# Altium schematic sheet analog.SchDoc: Scalony Skaner Bioimpedancji
size A4; DrawnBy: Łukasz Przeniosło; Organization: Zachodniopomorski; Address1: Uniwersytet Technologiczny; Address2: w Szczecinie; Address3: Wydział Elektryczny; Address4: Katedra KISSE; Revision: 1.0; SheetNumber: 3; SheetTotal: 7
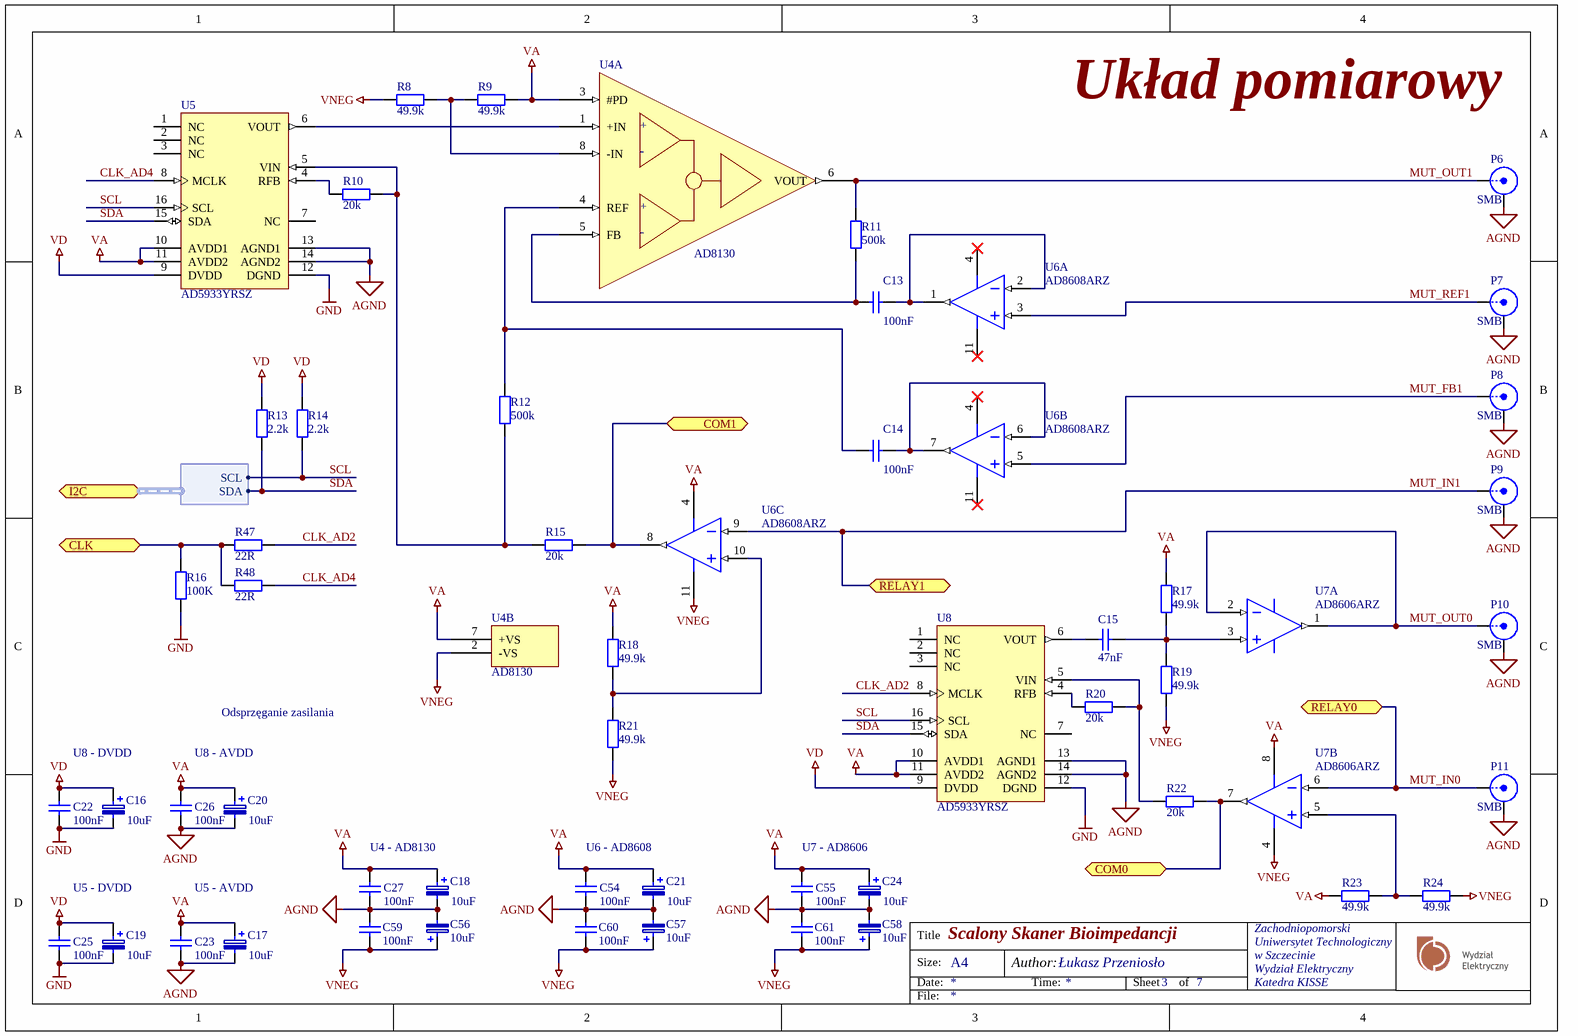
[diagram p0: analog.SchDoc]

## Parts
(Parts that share a designator on the sheet are numbered #1, #2 ... from top to bottom, then left to right.)
C13  100nF  [CAPC1608N]
C14  100nF  [CAPC1608N]
C15  47nF  [CAPC1608N]
C16  10uF  [SMDA]
C17  10uF  [SMDA]
C18  10uF  [SMDA]
C19  10uF  [SMDA]
C20  10uF  [SMDA]
C21  10uF  [SMDA]
C22  100nF  [CAPC1608N]
C23  100nF  [CAPC1608N]
C24  10uF  [SMDA]
C25  100nF  [CAPC1608N]
C26  100nF  [CAPC1608N]
C27  100nF  [CAPC1608N]
C54  100nF  [CAPC1608N]
C55  100nF  [CAPC1608N]
C56  10uF  [SMDA]
C57  10uF  [SMDA]
C58  10uF  [SMDA]
C59  100nF  [CAPC1608N]
C60  100nF  [CAPC1608N]
C61  100nF  [CAPC1608N]
P6  SMB  [SMB_V-RJ45]
P7  SMB  [SMB_V-RJ45]
P8  SMB  [SMB_V-RJ45]
P9  SMB  [SMB_V-RJ45]
P10  SMB  [SMB_V-RJ45]
P11  SMB  [SMB_V-RJ45]
R8  49.9k  [RESC1608N]
R9  49.9k  [RESC1608N]
R10  20k  [RESC1608N]
R11  500k  [RESC1608N]
R12  500k  [RESC1608N]
R13  2.2k  [RESC1608N]
R14  2.2k  [RESC1608N]
R15  20k  [RESC1608N]
R16  100K  [RESC1608N]
R17  49.9k  [RESC1608N]
R18  49.9k  [RESC1608N]
R19  49.9k  [RESC1608N]
R20  20k  [RESC1608N]
R21  49.9k  [RESC1608N]
R22  20k  [RESC1608N]
R23  49.9k  [RESC1608N]
R24  49.9k  [RESC1608N]
R47  22R  [RESC1608N]
R48  22R  [RESC1608N]
U4  AD8130  [SO-8_M]  (parts A,B of 2)
U5  AD5933YRSZ  [ADI-RS-16_L]
U6  AD8608ARZ  [ADI-R-14_N]  (parts A,B,C of 4)
U7#1  AD8606ARZ  [SOIC127P600-8AL]  (part A of 2)
U7#2  AD8606ARZ  [SOIC127P600-8AL]  (part B of 2)
U8  AD5933YRSZ  [ADI-RS-16_L]

## Ports
CLK, COM0, COM1, I2C (harness I2C), RELAY0, RELAY1

## Harnesses
I2C: SCL, SDA

## Nets
AGND: C17.2 C18.2 C20.2 C21.2 C23.1 C24.2 C26.1 C27.1 C54.1 C55.1 C56.2 C57.2 C58.2 C59.1 C60.1 C61.1 P6.2(Y) P7.2(Y) P8.2(Y) P9.2(Y) P10.2(Y) P11.2(Y) U5.13(AGND1) U5.14(AGND2) U8.13(AGND1) U8.14(AGND2)
GND: C16.2 C19.2 C22.1 C25.1 R16.2 U5.12(DGND) U8.12(DGND)
VA: C17.1 C18.1 C20.1 C21.1 C23.2 C24.1 C26.2 C27.2 C54.2 C55.2 R9.1 R17.1 R18.1 R23.1 U4.3(#PD) U4.7(+VS) U5.10(AVDD1) U5.11(AVDD2) U6.4(+V) U7#2.8(+V) U8.10(AVDD1) U8.11(AVDD2)
VD: C16.1 C19.1 C22.2 C25.2 R13.1 R14.1 U5.9(DVDD) U8.9(DVDD)
VNEG: C56.1 C57.1 C58.1 C59.2 C60.2 C61.2 R8.2 R19.2 R21.2 R24.2 U4.2(-VS) U6.11(-V) U7#2.4(-V)
CLK: R16.1 R47.2 R48.2 ; port CLK
CLK_AD2: R47.1 U8.8(MCLK)
CLK_AD4: R48.1 U5.8(MCLK)
COM0: R22.1 U7#2.7(OUT_B) ; port COM0
COM1: R15.1 U6.8(OUT_C) ; port COM1
MUT_FB1: P8.1(X) U6.5(+IN_B)
MUT_IN0: P11.1(X) U7#2.6(-IN_B) ; port RELAY0
MUT_IN1: P9.1(X) U6.9(-IN_C) ; port RELAY1
MUT_OUT0: P10.1(X) U7#1.1(OUT_A) U7#1.2(-IN_A)
MUT_OUT1: P6.1(X) R11.1 U4.6(VOUT)
MUT_REF1: P7.1(X) U6.3(+IN_A)
SCL: R14.2 U5.16(SCL) U8.16(SCL) ; port I2C.SCL
SDA: R13.2 U5.15(SDA) U8.15(SDA) ; port I2C.SDA
NetC13_1: C13.1 U6.1(OUT_A) U6.2(-IN_A)
NetC13_2: C13.2 R11.2 U4.5(FB)
NetC14_1: C14.1 U6.6(-IN_B) U6.7(OUT_B)
NetC14_2: C14.2 R12.1 U4.4(REF)
NetC15_1: C15.1 R17.2 R19.1 U7#1.3(+IN_A)
NetC15_2: C15.2 U8.6(VOUT)
NetR8_1: R8.1 R9.2 U4.8(-IN)
NetR10_1: R10.1 R12.2 R15.2 U5.5(VIN)
NetR10_2: R10.2 U5.4(RFB)
NetR18_2: R18.2 R21.1 U6.10(+IN_C)
NetR20_1: R20.1 U8.4(RFB)
NetR20_2: R20.2 R22.2 U8.5(VIN)
NetR23_2: R23.2 R24.1 U7#2.5(+IN_B)
NetU4_1: U4.1(+IN) U5.6(VOUT)

Not connected (* = marked no-connect by the designer): U5 1(NC) 2(NC) 3(NC) 7(NC); U7#1 4(-V) 8(+V); U8 1(NC) 2(NC) 3(NC) 7(NC)

## Notes on the sheet
- Układ pomiarowy
- Odsprzęganie zasilania
- U8 - DVDD
- U8 - AVDD
- U4 - AD8130
- U6 - AD8608
- U7 - AD8606
- U5 - DVDD
- U5 - AVDD
- Title
- Size:
- Date:
- A4
- Author:
- Time:
- Sheet
- of
- File:
- (in symbol AD8130, part A) +; -

## Library data of the parts
C13-C15 C22 C23 C25-C27 C54 C55 C59-C61 = Capacitor
  C13 C14 C22 C23 C25-C27 C54 C55 C59-C61: Value: 100nF
  C15: Value: 47nF
C16-C21 C24 C56-C58 = 100uF 6.3V-SMDB: Polarized Capacitor (Surface Mount); PackageReference: SMDB; Manufacturer: *; Manufacturer Part No.: *; Distributor: tme.pl; Distributor Order Code: TC 100/6.3-SMDB; tme.pl: TC 100/6.3-SMDB; Value: 10uF; farnell: 1135048
P6-P11 = SMB: SMB Straight Connector; LatestRevisionDate: 17-Jul-2002; LatestRevisionNote: Re-released for DXP Platform.; Publisher: Altium Limited
R8-R12 R15 R17-R24 R47 R48 = Resistor: Tolerance: 5%; Power: 0W
  R8 R9 R17-R19 R21 R23 R24: Value: 49.9k
  R10 R15 R20 R22: Value: 20k
  R11 R12: Value: 500k
  R47 R48: Value: 22R
R13 R14 R16 = Resistor: Power: 0W; Tolerance: 5%
  R13 R14: Value: 2.2k
  R16: Value: 100K
U5 U8 = CMP-0293-00046-1: 1 MSPS, 12-Bit Impedance Converter, Network Analyzer, Serial, RS-16, 77 Tube, Pb-Free; Tuning Word Width (bits): 27bit; I Supply total (max): 15mA; Master fclk: 16.776MHz; Resolution (Bits): 12bit; PackageVersion: 3/17/2005; I/O Interface: Serial; ComponentLink2URL: http://www.analog.com/static/imported-files/data_sheets/AD5933.pdf; PackageReference: RS-16; ComponentLink2Description: Datasheet; ComponentLink1URL: www.analog.com; Code_JEDEC: MO-150-AC; PackageDescription: 16-Lead Shrink Small Outline Package [SSOP]; ComponentLink1Description: Manufacturer URL; ComponentLink3URL: http://www.analog.com/static/imported-files/packages/31572257652246RS_16.pdf; ComponentLink3Description: Package Specification; DatasheetVersion: Rev. D
U6 = CMP-0384-00479-2: Quad Channel Wide Bandwidth Operational Amplifier, 10 MHz BW, 5 V/us SR, Industrial, 14-pin SOIC (R-14), Tube; Manufacturer: Analog Devices; Generic Part Number: AD8608; V Span Min: 2.7V; V Span Max: 6V; Input Bias Current: 200fA; Amplifiers Per Package: 4; Small Signal Bandwidth: 10MHz; Input Offset Voltage: 20uV; Slew Rate: 5V/us; Iq/Amp: 1.2mA; PackageReference: R-14; Mounting Technology: Surface Mount; ComponentLink3URL: http://www.analog.com/static/imported-files/packages/PKG_PDF/SOIC_Narrow%20(R)/R_14.pdf; ComponentLink1Description: Manufacturer URL; PackageVersion: 060606-A; ComponentLink3Description: Package Specification; ComponentLink1URL: http://www.analog.com/en/index.html; ComponentLink4Description: Reference Circuit; ComponentLink2URL: http://www.analog.com/static/imported-files/data_sheets/AD8605_8606_8608.pdf; DatasheetVersion: Rev. L; RevisionNote: Reference Circuit URL fixed; PackageDescription: 14-Pin Standard Small Outline Package, Body 8.65 x 3.9 mm, Pitch 1.27 mm; ComponentLink2Description: Datasheet; Code_JEDEC: MS-012-AB; PartNumber: AD8608ARZ; ComponentLink4URL: http://www.analog.com/en/all-operational-amplifiers-op-amps/operational-amplifiers-op-amps/ad8608/products/product.html#product-recommendations
U7#1 U7#2 = CMP-0384-01321-1: Double Channel Wide Bandwidth Operational Amplifier, 10 MHz BW, 5 V/us SR, Industrial, 8-pin SOIC (R-8), Tube; Generic Part Number: AD8606; Manufacturer: Analog Devices; Small Signal Bandwidth: 10MHz; V Span Min: 2.7V; Input Offset Voltage: 20uV; Amplifiers Per Package: 2; Iq/Amp: 1.2mA; Input Bias Current: 200fA; V Span Max: 6V; Slew Rate: 5V/us; ComponentLink3URL: http://www.analog.com/static/imported-files/packages/PKG_PDF/SOIC_Narrow%20(R)/R_8.pdf; Code_JEDEC: MS-012-AA; Mounting Technology: Surface Mount; PackageVersion: 060506-A; ComponentLink1URL: http://www.analog.com/en/index.html; PackageDescription: 8-Pin Standard Small Outline Package, Body 3.9 x 4.9 mm, Pitch 1.27 mm; ComponentLink4URL: Reference Circuit:http://www.analog.com/en/all-operational-amplifiers-op-amps/operational-amplifiers-op-amps/ad8606/products/product.html#product-recommendations; ComponentLink3Description: Package Specification; ComponentLink1Description: Manufacturer URL; ComponentLink2URL: http://www.analog.com/static/imported-files/data_sheets/AD8605_8606_8608.pdf; ComponentLink2Description: Datasheet; PartNumber: AD8606ARZ; ComponentLink4Description: URL Link1; DatasheetVersion: Rev. L; PackageReference: R-8